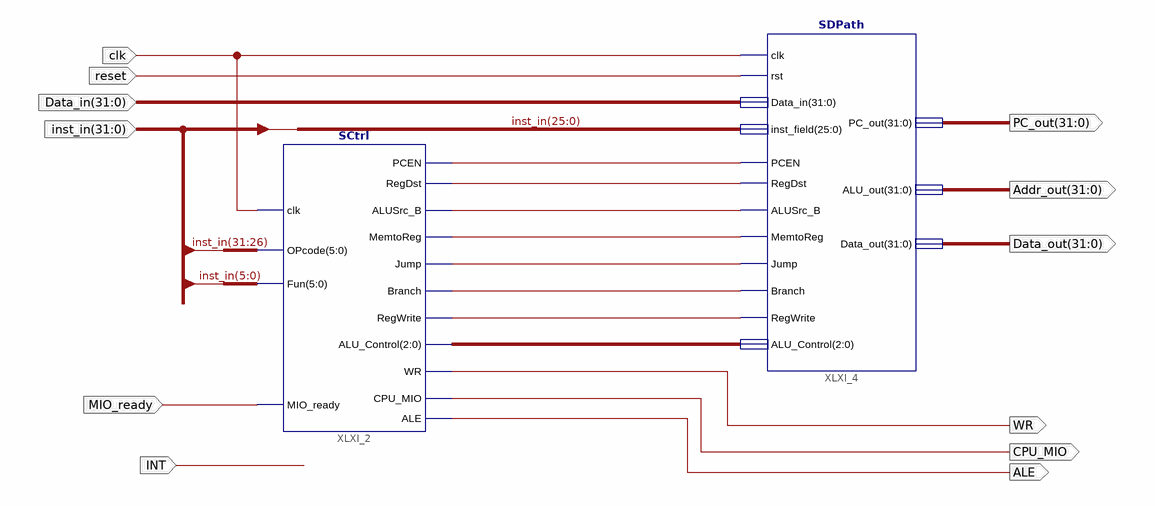
[diagram p0: schematic sheet 1]
// Xilinx ISE schematic SCPU.sch (kintex7) as structural Verilog: 2 symbols, 12 ports
module SCPU (
  input  clk,
  input  [31:0] Data_in,
  input  reset,
  input  MIO_ready,
  input  INT,
  input  [31:0] inst_in,
  output WR,
  output CPU_MIO,
  output ALE,
  output [31:0] PC_out,
  output [31:0] Addr_out,
  output [31:0] Data_out
);

  wire XLXN_11, XLXN_12, XLXN_13, XLXN_14, XLXN_15, XLXN_16, XLXN_17;
  wire [2:0] XLXN_18;

  SCtrl XLXI_2 (
    .Fun(inst_in[5:0]), .MIO_ready(MIO_ready), .OPcode(inst_in[31:26]), .clk(clk), .RegDst(XLXN_12),
    .ALUSrc_B(XLXN_13), .MemtoReg(XLXN_14), .Jump(XLXN_15), .Branch(XLXN_16), .RegWrite(XLXN_17),
    .ALU_Control(XLXN_18), .CPU_MIO(CPU_MIO), .WR(WR), .PCEN(XLXN_11), .ALE(ALE));
  SDPath XLXI_4 (
    .RegDst(XLXN_12), .ALUSrc_B(XLXN_13), .MemtoReg(XLXN_14), .Jump(XLXN_15), .Branch(XLXN_16),
    .RegWrite(XLXN_17), .ALU_Control(XLXN_18), .PC_out(PC_out), .ALU_out(Addr_out), .Data_out(Data_out),
    .rst(reset), .clk(clk), .PCEN(XLXN_11), .Data_in(Data_in), .inst_field(inst_in[25:0]));
endmodule
